# EAGLE design 01_InputStage_v1 (EAGLE 9.6.2)
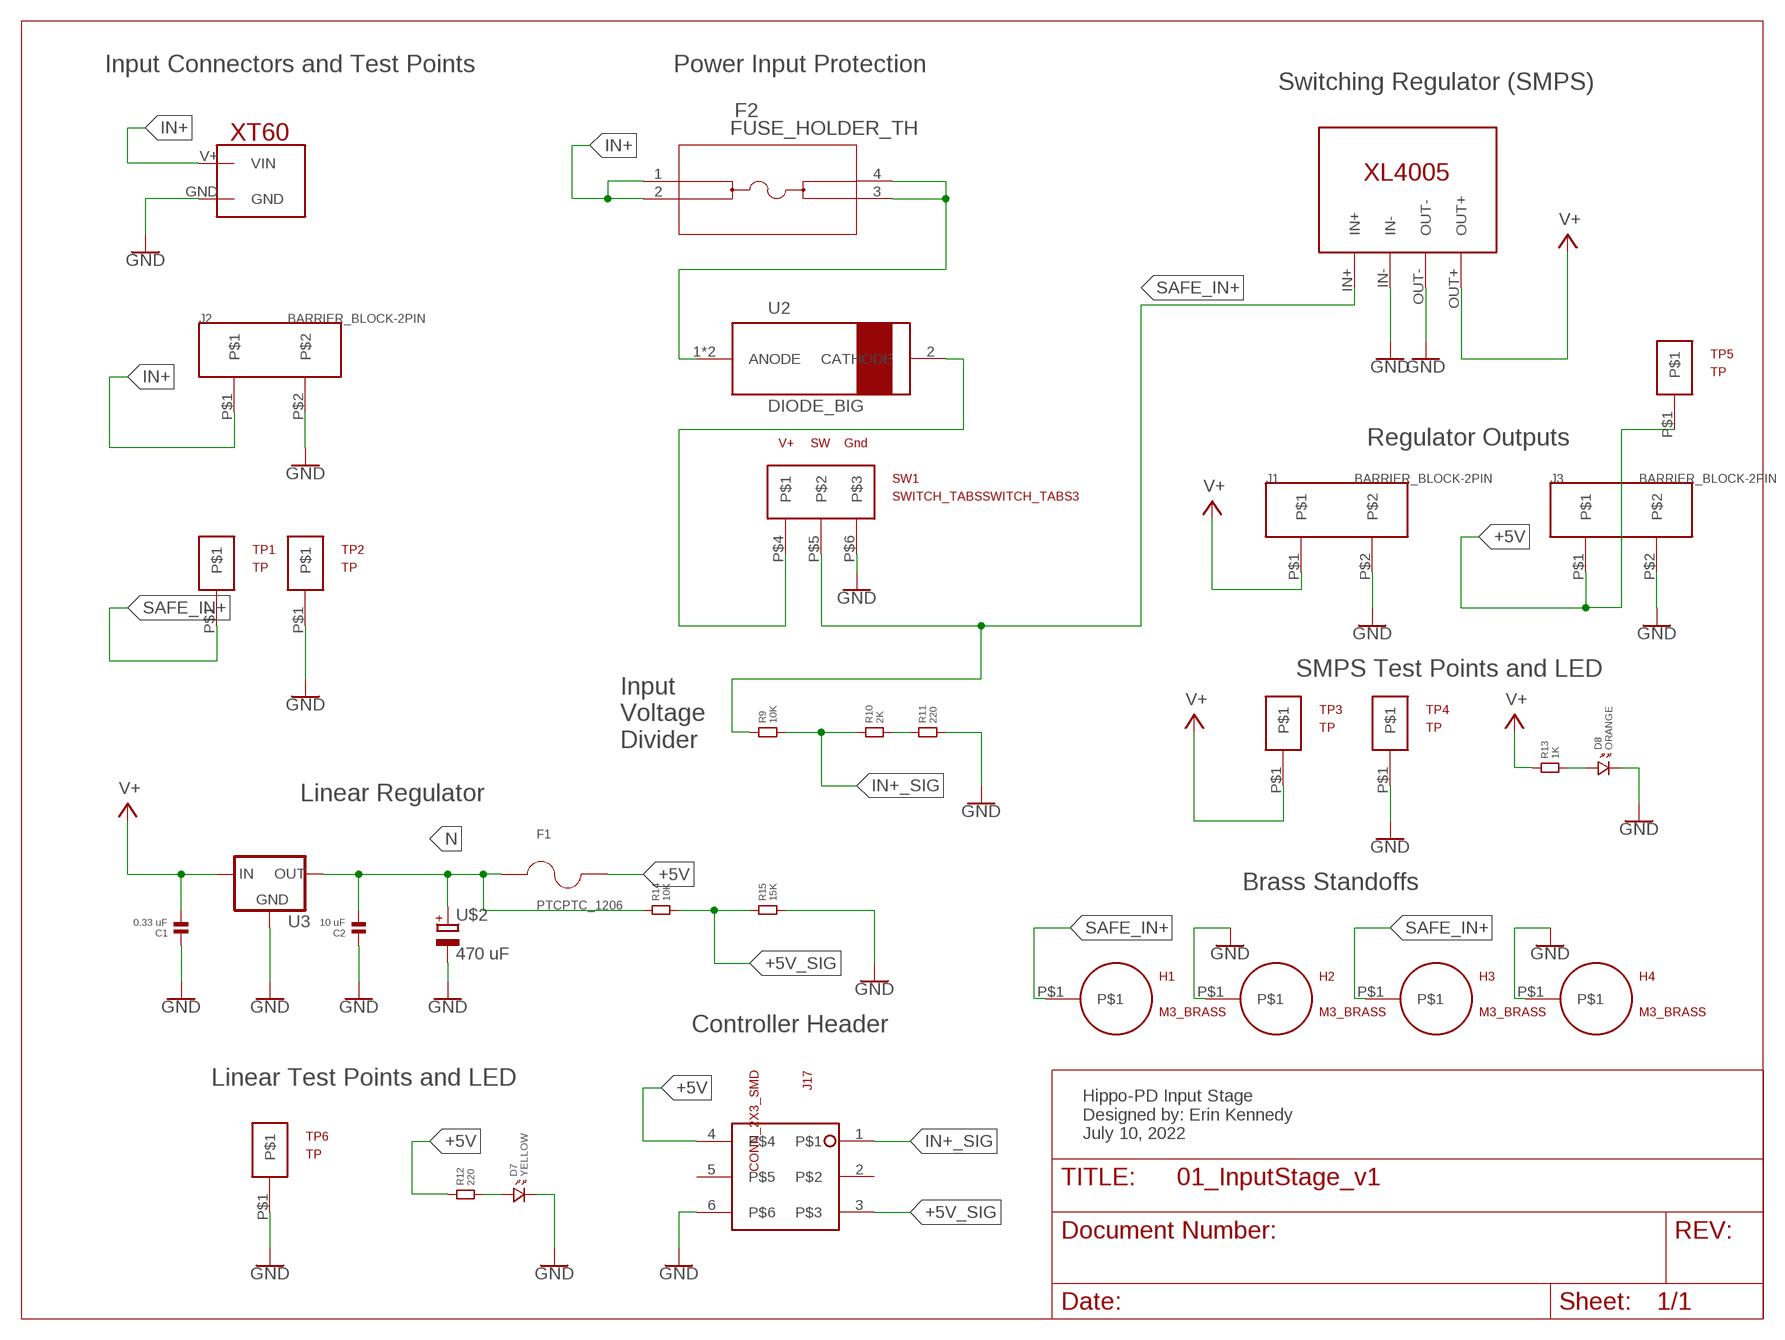
[diagram p0: schematic, sheet 1]

## Parts
C1  0.33 uF  CAPACITOR.1206  [1206]
C2  10 uF  CAPACITOR.1206  [1206]
D7  YELLOW  LED.1206  [1206.LED]
D8  ORANGE  LED.1206  [1206.LED]
F1  PTCPTC_1206  [1206]
F2  FUSE_HOLDER_TH  [FUSE_HOLDER_TH]
H1  M3_BRASS  [M3_BRASS]
H2  M3_BRASS  [M3_BRASS]
H3  M3_BRASS  [M3_BRASS]
H4  M3_BRASS  [M3_BRASS]
J1  BARRIER_BLOCK-2PIN  [BARRIERBLOCK-2PIN]
J2  BARRIER_BLOCK-2PIN  [BARRIERBLOCK-2PIN]
J3  BARRIER_BLOCK-2PIN  [BARRIERBLOCK-2PIN]
J17  CONN_2X3_SMD  [2X3_SMD_CONNECTOR]
R9  10K  RESISTOR.1206  [1206]
R10  2K  RESISTOR.1206  [1206]
R11  220  RESISTOR.1206  [1206]
R12  220  RESISTOR.1206  [1206]
R13  1K  RESISTOR.1206  [1206]
R14  10K  RESISTOR.1206  [1206]
R15  15K  RESISTOR.1206  [1206]
SW1  SWITCH_TABSSWITCH_TABS3  [SWITCH_TABS3]
TP1  TP  [TP]
TP2  TP  [TP]
TP3  TP  [TP]
TP4  TP  [TP]
TP5  TP  [TP]
TP6  TP  [TP]
U1  XL4005-DEV  [XL4005-DEV]
U2  DIODE_BIG  [DIODE_BIG]
U3  V_REG_78XXSINK  [TO220-IGO]
U$2  470 uF  ELECTROLYTIC_CAP  [ELECTROLYTIC_CAP]
U$5  XT60  [XT60]

## Nets
+5V: F1.2 J3.P$1 J17.4 R12.1 TP5.P$1
+5V_SIG: J17.3 R14.2 R15.1
GND: C1.1 C2.1 D7.P$2 D8.P$2 H2.P$1 H4.P$1 J1.P$2 J2.P$2 J3.P$2 J17.6 R11.2 R15.2 SW1.P$6 TP2.P$1 TP4.P$1 TP6.P$1 U1.IN- U1.OUT- U3.GND U$2.- U$5.GND
IN+: F2.1 F2.2 J2.P$1 U$5.V+(VIN)
IN+_SIG: J17.1 R9.2 R10.1
N: C2.2 F1.1 R14.1 U3.OUT U$2.+
N$1: F2.3 F2.4 U2.1(ANODE) U2.3(ANODE)
N$2: SW1.P$4 U2.2(CATHODE)
N$3: R10.2 R11.1
N$5: D8.P$1 R13.2
N$6: D7.P$1 R12.2
SAFE_IN+: H1.P$1 H3.P$1 R9.1 SW1.P$5 TP1.P$1 U1.IN+
V+: C1.2 J1.P$1 R13.1 TP3.P$1 U1.OUT+ U3.IN
Unconnected: J17.2 J17.5

## Notes on the sheet
- Input Connectors and Test Points | Power Input Protection
- Switching Regulator (SMPS)
- Regulator Outputs
- SMPS Test Points and LED
- Input
  Voltage
  Divider
- Linear Regulator
- Brass Standoffs
- Controller Header
- Linear Test Points and LED
- Hippo-PD Input Stage
  Designed by: Erin Kennedy
  July 10, 2022

## Library data of the parts
C1 C2 = standardparts:CAPACITOR
D7 D8 = standardparts:LED
F1 = Hippo-PS:PTC: PTC Resettable Fuse 0.75A(hold) 1.5A(trip) 60VDC 40A 1.5W 0.3s 0.18Ohm SMD Solder Pad 7.98 X 5.44 X 1.15mm T/R Check availability <https://pricing.snapeda.com/parts/0ZCF0075AF2C/Bel%20Fuse/view-part?ref=eda>
F2 = Hippo-PS:FUSE_HOLDER_TH; COPYRIGHT: Copyright (C) 2022 Ultra Librarian. All rights reserved.; DIGI-KEY_PART_NUMBER_1: 36-3557-10-ND; MANUFACTURER_PART_NUMBER: 3557-10; MFR_NAME: Keystone Electronics
H1-H4 = Hippo-PS:M3_BRASS
J1-J3 = Hippo-PS:BARRIER_BLOCK-2PIN: Barrier block connector Digikey #ED2946-ND
J17 = Hippo-PS:CONN_2X3_SMD
R9-R15 = standardparts:RESISTOR
SW1 = Hippo-PS:SWITCH_TABS
TP1-TP6 = Hippo-PS:TP
U1 = Hippo-PS:XL4005-DEV
U2 = Hippo-PS:DIODE_BIG: Check availability <https://pricing.snapeda.com/parts/TS2940CM50%20RNG/Taiwan%20Semiconductor%20Corporation/view-part?ref=eda>; AVAILABILITY: In Stock; DESCRIPTION: 1A 5V ULTRA LOW DROPOUT VOLTAGE REGULATOR; MF: Taiwan Semiconductor Corporation; MP: TS2940CM50 RNG; PACKAGE: TO-263 Taiwan Semiconductor; PRICE: None; PURCHASE-URL: https://pricing.snapeda.com/search/part/TS2940CM50 RNG/?ref=eda
U3 = Hippo-PS:V_REG_78XX: Voltage Regulator Standard 78xx regulator. IGO (Input Ground Output). Spark Fun Electronics SKU : COM-00107
U$2 = Hippo-PS:ELECTROLYTIC_CAP: Check availability <https://pricing.snapeda.com/parts/865080545012/Wurth%20Electronics/view-part?ref=eda>; AVAILABILITY: In Stock; DESCRIPTION: 100 µF 35 V Aluminum Electrolytic Capacitors Radial, Can - SMD - 2000 Hrs @ 105°C; MF: Wurth Electronics; MP: 865080545012; PACKAGE: Radial Würth Elektronik; PRICE: None; PURCHASE-URL: https://pricing.snapeda.com/search/part/865080545012/?ref=eda
U$5 = Hippo-PS:XT60: XT60

## Board
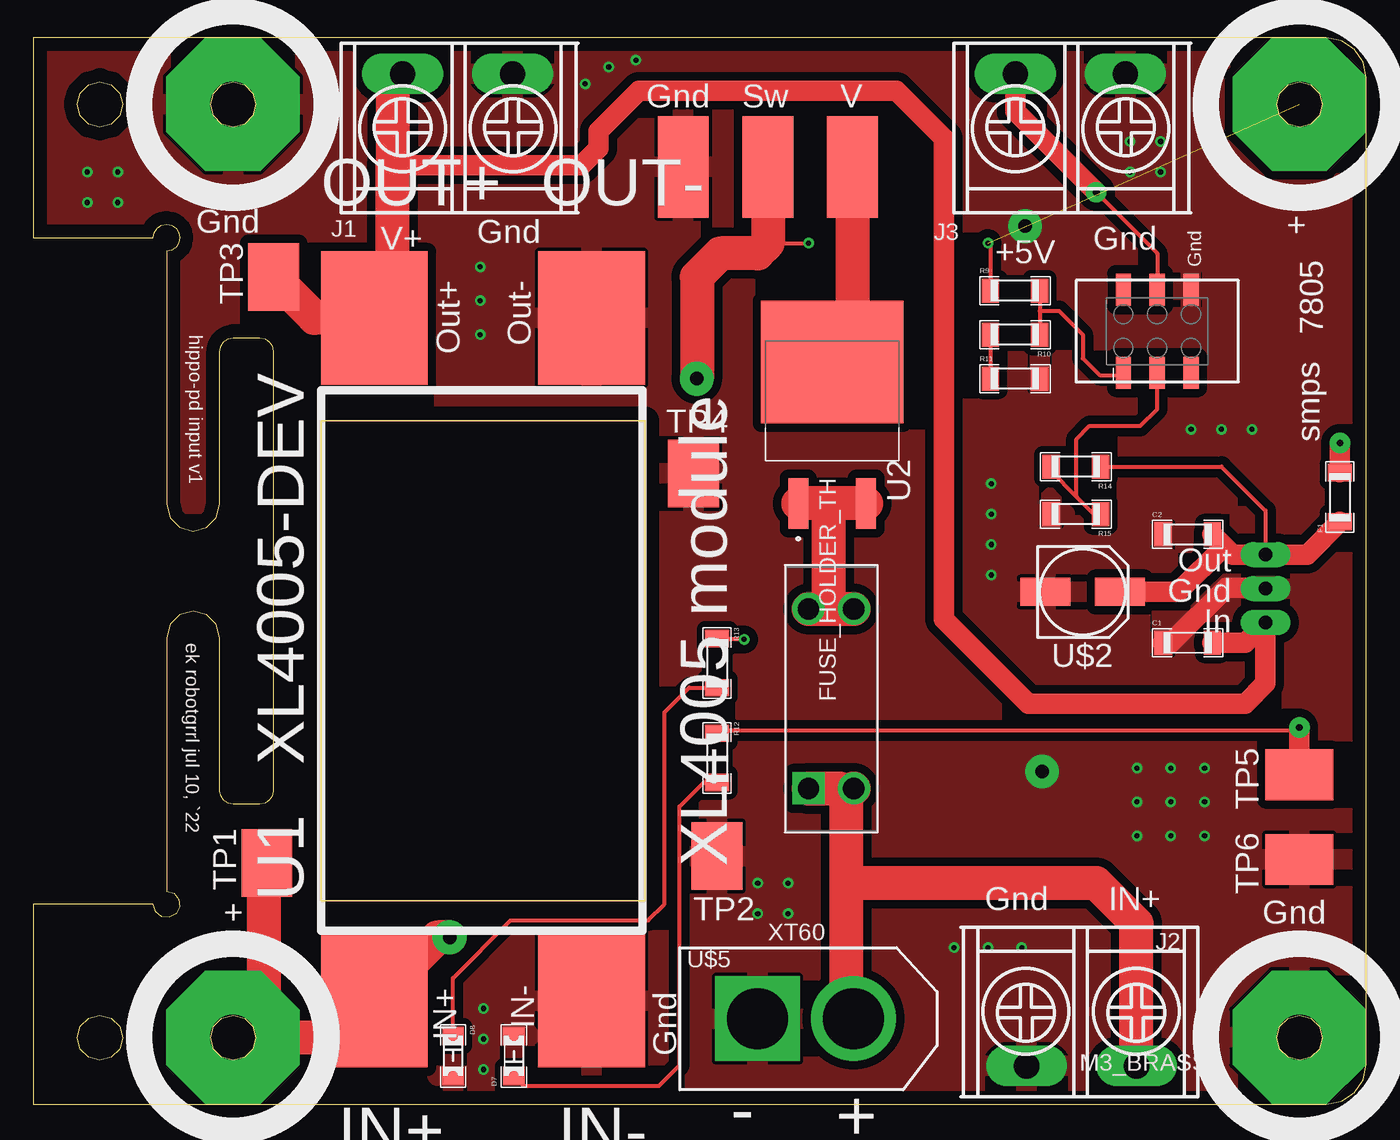
[diagram p1: board, top side]
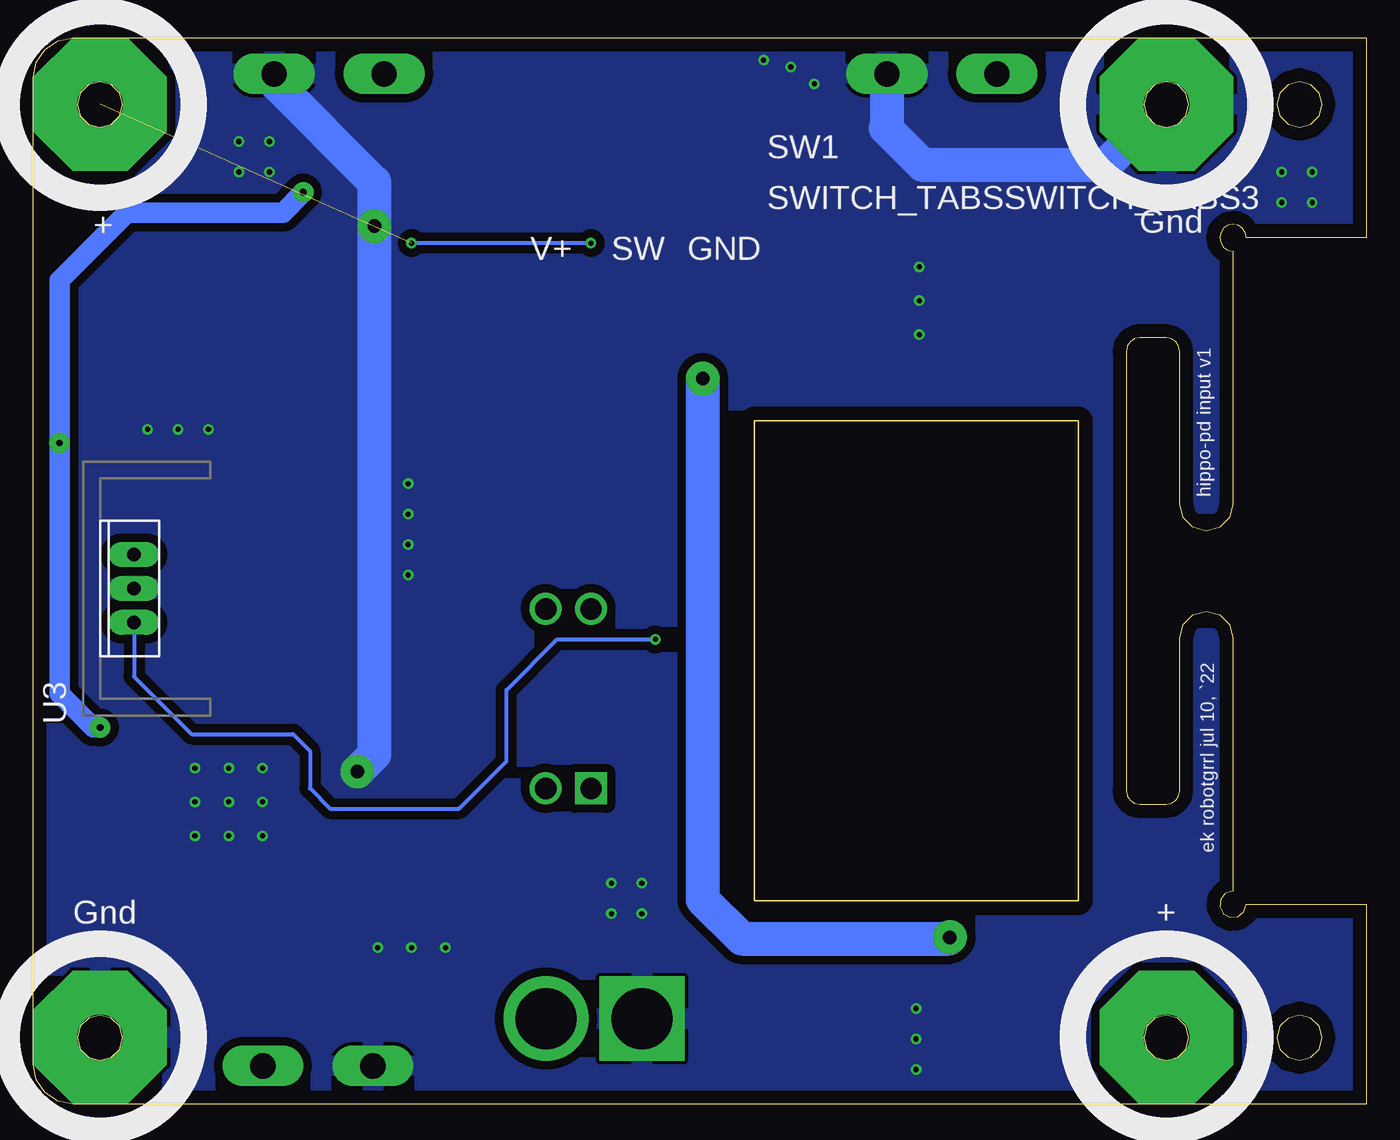
[diagram p2: board, bottom side, seen from below]

Size 100 x 80 mm. Coordinates in mm from the lower left corner, seen from the top.
Outline: 100,77 99.77,78.15 99.12,79.12 98.15,79.77 97,80 0,80 0,65 9,65 9.08,65.39 9.29,65.71 9.61,65.92 10,66 10.39,65.92 10.71,65.71 10.92,65.39 11,65 10.92,64.61 10.71,64.29 10.39,64.08 10,64 10,45 10.27,44 11,43.27 12,43 13,43.27 13.73,44 14,45 14,56.5 14.08,56.89 14.29,57.21 14.61,57.42 15,57.5 17,57.5 17.39,57.42 17.71,57.21 17.92,56.89 18,56.5 18,23.5 17.92,23.11 17.71,22.79 17.39,22.58 17,22.5 15,22.5 14.61,22.58 14.29,22.79 14.08,23.11 14,23.5 14,35 13.73,36 13,36.73 12,37 11,36.73 10.27,36 10,35 10,16 10.56,15.83 10.92,15.38 10.98,14.8 10.71,14.29 10.2,14.02 9.62,14.08 9.17,14.44 9,15 0,15 0,0 97,0 98.15,0.23 99.12,0.88 99.77,1.85 100,3 100,77
Outline: 6.7,75 6.47,74.15 5.85,73.53 5,73.3 4.15,73.53 3.53,74.15 3.3,75 3.53,75.85 4.15,76.47 5,76.7 5.85,76.47 6.47,75.85 6.7,75
Outline: 96.7,75 96.47,74.15 95.85,73.53 95,73.3 94.15,73.53 93.53,74.15 93.3,75 93.53,75.85 94.15,76.47 95,76.7 95.85,76.47 96.47,75.85 96.7,75
Outline: 96.7,5 96.47,4.15 95.85,3.53 95,3.3 94.15,3.53 93.53,4.15 93.3,5 93.53,5.85 94.15,6.47 95,6.7 95.85,6.47 96.47,5.85 96.7,5
Outline: 16.7,75 16.47,74.15 15.85,73.53 15,73.3 14.15,73.53 13.53,74.15 13.3,75 13.53,75.85 14.15,76.47 15,76.7 15.85,76.47 16.47,75.85 16.7,75
Outline: 16.7,5 16.47,4.15 15.85,3.53 15,3.3 14.15,3.53 13.53,4.15 13.3,5 13.53,5.85 14.15,6.47 15,6.7 15.85,6.47 16.47,5.85 16.7,5
Outline: 6.7,5 6.47,4.15 5.85,3.53 5,3.3 4.15,3.53 3.53,4.15 3.3,5 3.53,5.85 4.15,6.47 5,6.7 5.85,6.47 6.47,5.85 6.7,5
Copper layers (1*16): Top 0.035mm / dielectric 1.5mm / Bottom 0.035mm
Design rules "default *": minimum track width 8mil, minimum drill 0.35mm, track to track 10mil, track to pad 10mil, pad to pad 10mil, via to via 10mil, smd to smd 10mil, copper to edge 40mil, drill to drill 10mil, minimum pad ring 10mil, minimum via ring 8mil, stop-mask expansion 4mil, vias tented up to drill 0mil, thermal gap 10mil

### Footprints (pad centres in the part's own frame; a part is rotated, then mirrored left to right if it is on the bottom)
1206 = smd 1.3 x 1.8: 1 -1.85,0; 2 1.85,0
1206.LED = smd 1.4 x 1.6: P$1 -1.5,0; P$2 1.5,0
FUSE_HOLDER_TH = drill 1.6 pad 2.108 square: 1 0,0 | drill 1.6 pad 2.108: 2 0,-3.404; 3 13.462,-3.404; 4 13.462,0
M3_BRASS = drill 3.4 pad 10 octagon: P$1 0,0
BARRIERBLOCK-2PIN = drill 1.905 pad 3.048 long: P$1 4.6,10.4; P$2 12.85,10.4
2X3_SMD_CONNECTOR = smd 1.147 x 2.408: 1 -2.54,-3.104; 2 -2.54,3.104; 3 0,-3.104; 4 0,3.104; 5 2.54,-3.104; 6 2.54,3.104
SWITCH_TABS3 = smd 3.81 x 7.62 bottom: P$4 -6.35,1.905; P$5 0,1.905; P$6 6.35,1.905
TP = smd 3.81 x 5.08: P$1 0,0
XL4005-DEV = smd 8 x 10: IN+ 4,-5; IN- 20.3,-5; OUT+ 4,46.2; OUT- 20.3,46.2
DIODE_BIG = smd 3.808 x 1.508: 1 -5.3,2.54; 3 -5.3,-2.54 | smd 9.2 x 10.67: 2 5.3,0
TO220-IGO = drill 1.016 pad 1.88 long: GND 0,0; IN -2.54,0; OUT 2.54,0
ELECTROLYTIC_CAP = smd 3.754 x 2.108: + 2.8,0; - -2.8,0
XT60 = drill 4.572 pad 6.35 square: GND 4.3,0 | drill 4.572 pad 6.35: V+ 11.5,0

### Placement (x,y rotation side)
C1  86.61,34.62 0 top
C2  86.61,42.75 0 top
D7  36.06,3.64 90 top
D8  31.49,3.64 270 top
F1  98.04,45.55 90 top
F2  58.16,23.7 90 top
H1  14.98,5.03 0 top
H2  94.99,5.03 0 top
H3  94.99,75.01 0 top
H4  14.98,75.01 0 top
J1  23.11,66.88 0 top
J2  87.37,13.29 180 top
J3  69.08,66.88 0 top
J17  84.32,57.99 0 top
R9  73.65,61.04 0 top
R10  73.65,57.74 180 top
R11  73.65,54.44 0 top
R12  51.3,25.99 270 top
R13  51.3,33.1 270 top
R14  78.22,47.83 180 top
R15  78.22,44.28 180 top
SW1  55.11,68.41 0 bottom
TP1  17.52,18.11 0 top
TP2  51.3,18.62 0 top
TP3  18.03,62.06 0 top
TP4  49.52,47.32 0 top
TP5  94.99,24.72 270 top
TP6  94.99,18.37 270 top
U1  21.58,12.78 0 top
U2  59.94,50.37 90 top
U3  92.45,38.69 90 bottom
U$2  78.73,38.43 0 top
U$5  50.03,6.43 0 top

### Tracks (layer width: path | path; a pad name or v marks a point on that pad's centre or on a via)
+5V  (via drill 0.51 pad 1.52)
  Top 0.305: R12.1 51.48,28.02 94.73,28.02 v94.99,28.27 | v79.75,68.41 84.32,63.83 J17.4
  Top 1.524: J3.P$1 73.68,74.47 v79.75,68.41 | v94.99,28.27 TP5.P$1 | F1.2 v98.04,49.61
  Bottom 1.524: v79.75,68.41 81.27,66.88 92.96,66.88 98.04,61.8 v98.04,49.61 98.04,30.81 95.5,28.27 v94.99,28.27
+5V_SIG
  Top 0.305: R15.1 79.57,44.28 78.26,45.58 | R14.2 76.37,47.47 78.26,45.58 | J17.3 84.32,52.15 83.05,50.88 79.24,50.88 78.26,49.9 78.26,45.58
GND  (via drill 0.38 pad 0.64, 1.02 pad 2.54)
  Top 1.524: U3.GND 92.37,38.76 89.5,38.76 85.36,34.62 C1.1
  Bottom 2.54: J1.P$2 35.96,73.34 36.06,73.23 33.27,70.44 19.55,70.44 H4.P$1 | J3.P$2 81.93,76.68 74.41,69.17 v74.41,65.87 74.41,26.24 v75.68,24.97
  other vias: 33.52,62.82 33.52,60.28 33.52,57.74 4.06,69.93 6.34,69.93 4.06,67.64 6.34,67.64 33.77,7.19 33.77,4.91 33.77,2.62 54.35,16.59 56.63,16.59 56.63,14.3 54.35,14.3 69.08,11.76 71.62,11.76 74.16,11.76 82.8,25.23 85.34,25.23 87.88,25.23 82.8,22.69 85.34,22.69 87.88,22.69 82.8,20.15 85.34,20.15 87.88,20.15 41.39,76.53 43.17,77.8 45.2,78.31 82.29,72.22 84.57,72.22 82.29,69.93 84.57,69.93 71.87,46.56 71.87,44.28 71.87,41.99 71.87,39.7 91.43,50.63 89.15,50.63 86.86,50.63
  pour Top (isolate 0.635): -9.41,89.74 108.45,89.74 108.45,-7.79 -10.42,-7.79 -10.42,-6.02 -10.42,89.74 -9.66,89.74
  pour Bottom (isolate 0.635): 103.88,92.28 -7.12,92.28 -7.12,-9.06 -7.12,-10.59 109.47,-10.59 109.47,92.28 109.21,92.28
IN+
  Top 2.54: 61.02,16.59 61.02,6.94 U$5.V+ | J2.P$1 82.77,13.57 79.75,16.59 61.02,16.59 | 61.02,16.59 61.02,23.16 | 61.02,23.16 F2.2 | F2.1 60.48,23.7 61.02,23.16
IN+_SIG
  Top 0.305: R9.2 75.5,59.52 | 75.5,59.52 R10.1 | 75.5,59.52 76.95,59.52 78.73,57.74 78.73,55.96 80,54.69 81.58,54.69 J17.1
N
  Top 0.305: R14.1 89.15,47.83 92.45,44.53 U3.OUT
  Top 1.524: 89.35,41.86 89.98,41.23 U3.OUT 95.57,41.23 F1.1 | 89.35,41.86 C2.2 | U$2.+ 85.92,38.43 89.35,41.86
N$1
  Top 2.54: U2.3 59.94,45.07 | 59.94,45.07 U2.1 | F2.4 59.68,37.16 | 59.68,37.16 F2.3 | 59.68,37.16 59.68,44.82 59.94,45.07
N$2
  Top 2.54: SW1.P$4 61.46,55.96 59.94,54.44 59.94,53.67 60.44,53.67 60.44,55.16 U2.2
N$3
  Top 0.305: R10.2 R11.1
N$5
  Top 0.305: D8.P$1 31.49,9.48 35.81,13.8 46.12,13.8 47.35,15.03 47.35,29.41 49.2,31.25 R13.2
N$6
  Top 0.305: R12.2 50.28,24.14 48.48,22.33 48.48,2.95 46.91,1.37 36.82,1.37 D7.P$1
SAFE_IN+  (via drill 0.38 pad 0.64, 1.02 pad 2.54)  (1 unrouted)
  Top 0.305: 55.11,64.6 v58.16,64.6 | v71.62,64.6 71.8,64.41 R9.1
  Top 2.54: SW1.P$5 55.11,64.6 54.35,63.83 51.55,63.83 49.78,62.06 v49.78,54.44 | v31.23,12.53 30.33,12.53 U1.IN+ 25.31,7.78 25.01,8.08 25.39,8.46 25.65,8.21 25.65,6.68 24,5.03 H1.P$1 17.26,7.32 17.26,17.86 TP1.P$1
  Bottom 0.305: v58.16,64.6 v71.62,64.6
  Bottom 2.54: v49.78,54.44 49.78,15.36 46.85,12.44 31.32,12.44 v31.23,12.53
V+  (via drill 0.38 pad 0.64)
  Top 0.305: v53.33,34.88 51.37,34.88 R13.1
  Top 1.524: C1.2 90.92,34.62 U3.IN 92.45,31.58 90.92,30.05 74.67,30.05 68.32,36.4 68.32,72.47 64.76,76.03 45.46,76.03 42.41,72.98 42.41,71.71 41.14,70.44 26.94,70.44
  Top 2.54: TP3.P$1 21.1,58.98 U1.OUT+ 25.14,58.54 25.14,57.23 26.94,59.04 26.94,70.44 26.94,76.52 J1.P$1
  Bottom 0.305: U3.IN 92.45,32.08 88.13,27.77 80.51,27.77 79.24,26.5 79.24,23.7 77.72,22.18 68.06,22.18 64.51,25.73 64.51,31.07 60.7,34.88 v53.33,34.88

### Text on the board
tPlace: Gnd | Sw | V | Gnd | Gnd | + | V+ | Gnd | +5V | 7805 | Gnd | Out+ | Out- | hippo-pd input v1 | smps | Out | Gnd | In | ek robotgrrl jul 10, `22 | Gnd | IN+ | + | Gnd | IN+ | IN- | Gnd
bPlace: Gnd | + | hippo-pd input v1 | ek robotgrrl jul 10, `22 | + | Gnd
tNames: word